# Altium schematic sheet CPU&POWER.SchDoc: MCU&Power
size 292 x 193 mm; Author: Michał Borkowski; CompanyName: Politechnika Warszawska; Organization: WEITI; Revision: 3; SheetNumber: 5; SheetTotal: 5; ProjName: Sweet Dreams; Group_Name: Under Pressure
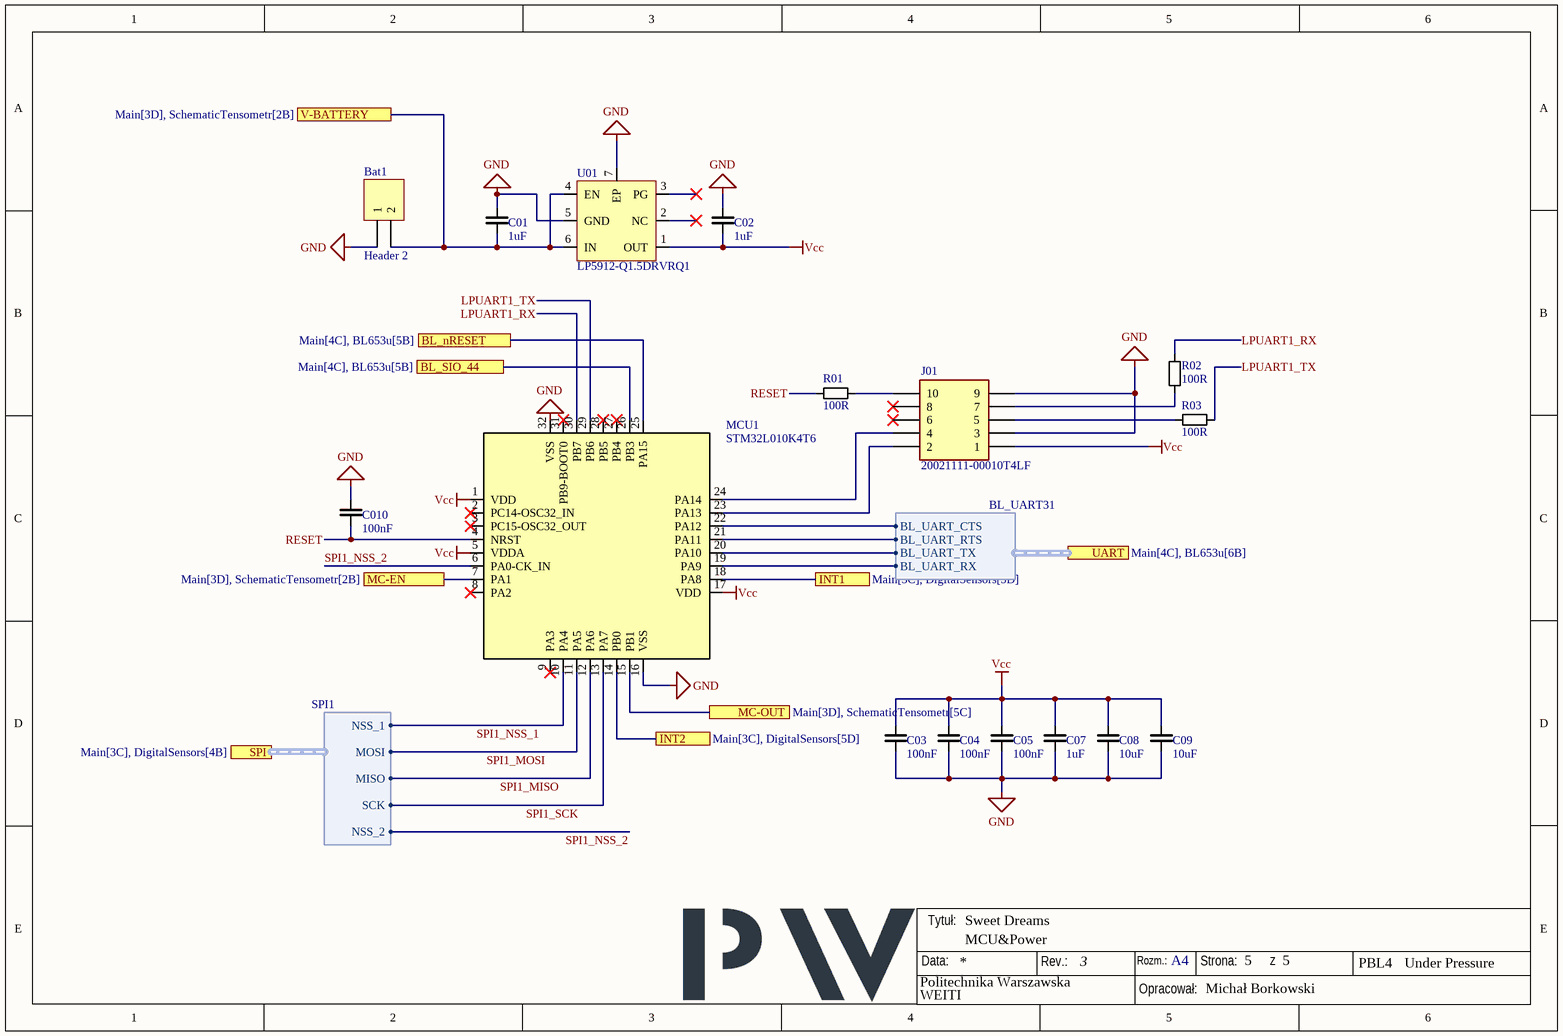
[diagram p0: CPU&POWER.SchDoc]

## Parts
Bat1  Header 2  [HDR1X2]
C01  1uF  [0402_CAP]
C02  1uF  [0402_CAP]
C03  100nF  [0402_CAP]
C04  100nF  [0402_CAP]
C05  100nF  [0402_CAP]
C07  1uF  [0402_CAP]
C08  10uF  [0402_CAP]
C09  10uF  [0402_CAP]
C010  100nF  [0402_CAP]
J01  20021111-00010T4LF  [HDRV10W41P127_2X5_635X343X575P_m]
MCU1  STM32L010K4T6  [QFP80P900X900X160-32N_m]
R01  100R  [0402_RES]
R02  100R  [0402_RES]
R03  100R  [0402_RES]
U01  LP5912-Q1.5DRVRQ1  [SON65P200X200X80-7N_m]

## Ports
BL_nRESET (see Main[4C], BL653u[5B]), BL_SIO_44 (see Main[4C], BL653u[5B]), INT1 (see Main[3C], DigitalSensors[5D]), INT2 (see Main[3C], DigitalSensors[5D]), MC-EN (see Main[3D], SchematicTensometr[2B]), MC-OUT (see Main[3D], SchematicTensometr[5C]), SPI (harness SPI1, see Main[3C], DigitalSensors[4B]), UART (harness BL_UART31, see Main[4C], BL653u[6B]), V-BATTERY (see Main[3D], SchematicTensometr[2B])

## Harnesses
SPI1: NSS_1, MOSI, MISO, SCK, NSS_2
BL_UART31: BL_UART_RTS, BL_UART_CTS, BL_UART_RX, BL_UART_TX

## Nets
GND: Bat1.1 C01.2 C02.2 C03.1 C04.1 C05.1 C07.1 C08.1 C09.1 C010.2 J01.3 J01.9 MCU1.16(VSS) MCU1.32(VSS) U01.5(GND) U01.7(EP)
Vcc: C02.1 C03.2 C04.2 C05.2 C07.2 C08.2 C09.2 J01.1 MCU1.1(VDD) MCU1.5(VDDA) MCU1.17(VDD) U01.1(OUT)
BL_nRESET: MCU1.25(PA15) ; port BL_nRESET
BL_SIO_44: MCU1.26(PB3) ; port BL_SIO_44
INT1: MCU1.18(PA8) ; port INT1
INT2: MCU1.14(PB0) ; port INT2
LPUART1_RX: MCU1.30(PB7) R02.2
LPUART1_TX: MCU1.29(PB6) R03.1
MC-EN: MCU1.7(PA1) ; port MC-EN
MC-OUT: MCU1.15(PB1) ; port MC-OUT
RESET: C010.1 MCU1.4(NRST) R01.1
SPI1_MISO: MCU1.12(PA6) ; port SPI.MISO
SPI1_MOSI: MCU1.11(PA5) ; port SPI.MOSI
SPI1_NSS_1: MCU1.10(PA4) ; port SPI.NSS_1
SPI1_NSS_2: MCU1.6(PA0-CK_IN) ; port SPI.NSS_2
SPI1_SCK: MCU1.13(PA7) ; port SPI.SCK
V-BATTERY: Bat1.2 C01.1 U01.4(EN) U01.6(IN) ; port V-BATTERY
NetJ01_2: J01.2 MCU1.23(PA13)
NetJ01_4: J01.4 MCU1.24(PA14)
NetJ01_5: J01.5 R03.2
NetJ01_7: J01.7 R02.1
NetJ01_10: J01.10 R01.2
NetMCU1_19: MCU1.19(PA9) ; port UART.BL_UART_RX
NetMCU1_20: MCU1.20(PA10) ; port UART.BL_UART_TX
NetMCU1_21: MCU1.21(PA11) ; port UART.BL_UART_RTS
NetMCU1_22: MCU1.22(PA12) ; port UART.BL_UART_CTS

Not connected (* = marked no-connect by the designer): J01 6* 8*; MCU1 2(PC14-OSC32_IN)* 3(PC15-OSC32_OUT)* 8(PA2)* 9(PA3)* 27(PB4)* 28(PB5)* 31(PB9-BOOT0)*; U01 2(NC)* 3(PG)*

## Notes on the sheet
- Data:
- Tytuł:
- Rev.:
- Rozm.:
- A4
- Strona:
- z
- PBL4
- Opracował:

## Library data of the parts
Bat1 = Header 2: Header, 2-Pin; LatestRevisionDate: 17-Jul-2002; LatestRevisionNote: Re-released for DXP Platform.; Publisher: Altium Limited
C01 C02 C03 C04 C05 C07 C08 C09 C010 = Cap: Ceramic capacitor
J01 = 20021111-00010T4LF: Connector; Manufacturer_Name: Amphenol Communications Solutions; Datasheet Link: https://cdn.amphenol-cs.com/media/wysiwyg/files/drawing/20021111.pdf; Height: 5.75mm; Manufacturer_Part_Number: 20021111-00010T4LF; Mouser Part Number: 649-221111-00010T4LF; Mouser Price/Stock: https://www.mouser.co.uk/ProductDetail/Amphenol-FCI/20021111-00010T4LF?qs=nwYJ12Fl9gR8B5xkaYs9gA%3D%3D; Arrow Part Number: 20021111-00010T4LF; Arrow Price/Stock: https://www.arrow.com/en/products/20021111-00010t4lf/amphenol-fci?region=europe
MCU1 = CPU32p
R01 R02 R03 = RES: Resistor
U01 = STAB